# EAGLE schematic Mars (EAGLE 8.0.0)
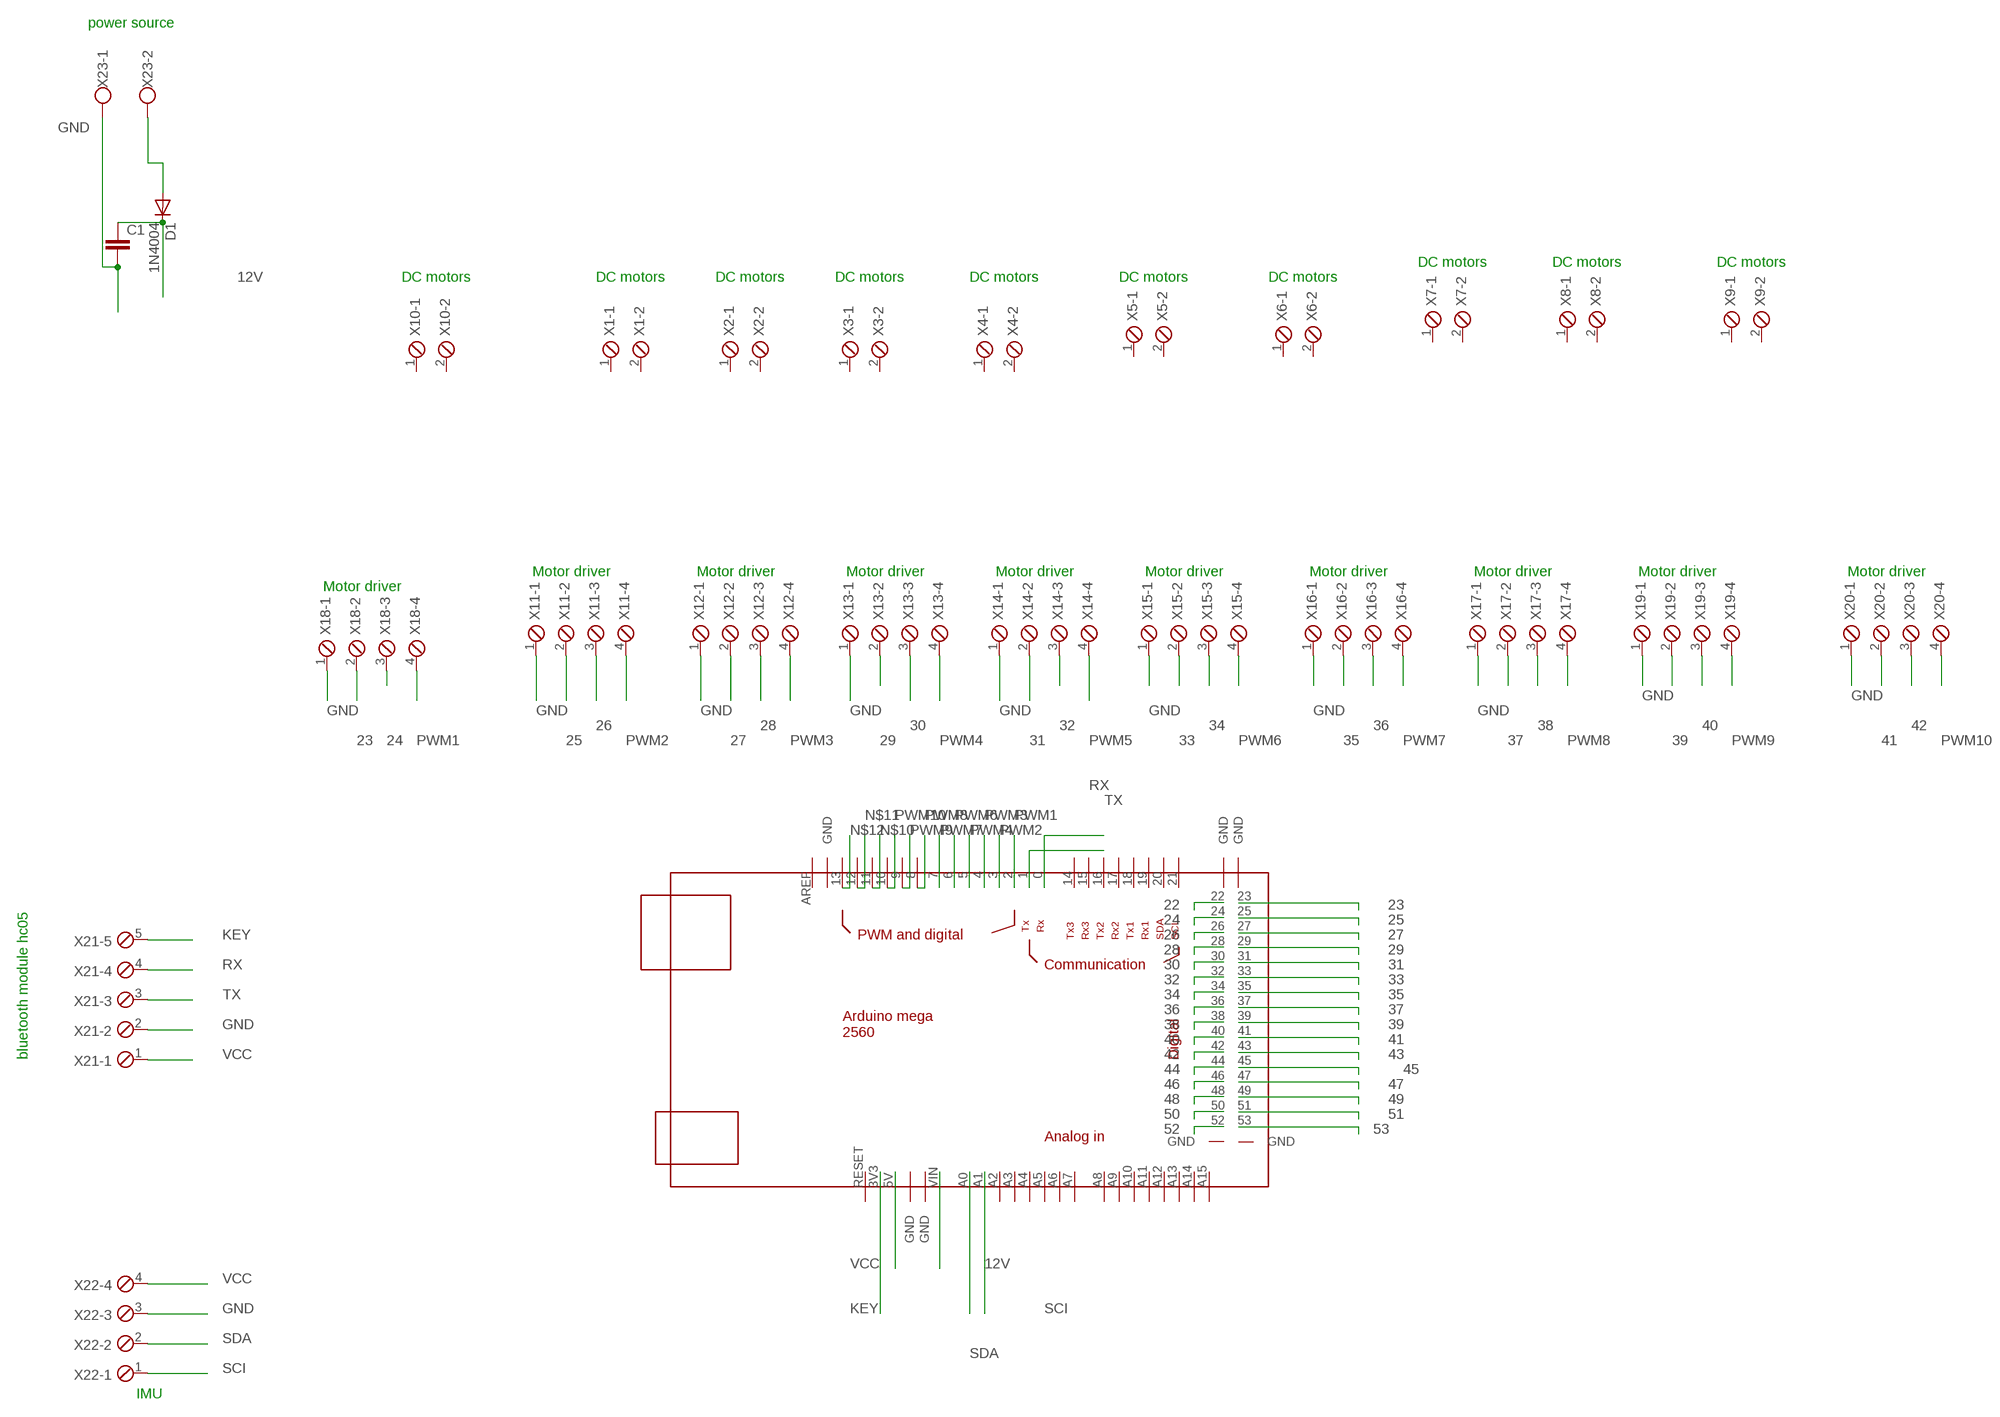
[diagram p0: schematic, sheet 1]

## Parts
C1  C-EU025-025X050  [C025-025X050]
D1  1N4004  [DO41-10]
U$1  MEGA_DEVICE  [MEGABOX]
X1  MPT2  [2POL254]
X2  MPT2  [2POL254]
X3  MPT2  [2POL254]
X4  MPT2  [2POL254]
X5  MPT2  [2POL254]
X6  MPT2  [2POL254]
X7  MPT2  [2POL254]
X8  MPT2  [2POL254]
X9  MPT2  [2POL254]
X10  MPT2  [2POL254]
X11  MPT4  [4POL254]
X12  MPT4  [4POL254]
X13  MPT4  [4POL254]
X14  MPT4  [4POL254]
X15  MPT4  [4POL254]
X16  MPT4  [4POL254]
X17  MPT4  [4POL254]
X18  MPT4  [4POL254]
X19  MPT4  [4POL254]
X20  MPT4  [4POL254]
X21  MPT5  [5POL254]
X22  MPT4  [4POL254]
X23  W237-113  [W237-113]

## Nets
12V: C1.1 D1.A D1.C U$1.VIN X23.2
22: U$1.22
23: U$1.23 X18.2
24: U$1.24 X18.3
25: U$1.25 X11.2
26: U$1.26 X11.3
27: U$1.27 X12.2
28: U$1.28 X12.3
29: U$1.29 X13.2
30: U$1.30 X13.3
31: U$1.31 X14.2
32: U$1.32 X14.3
33: U$1.33 X15.2
34: U$1.34 X15.3
35: U$1.35 X16.2
36: U$1.36 X16.3
37: U$1.37 X17.2
38: U$1.38 X17.3
39: U$1.39 X19.2
40: U$1.40 X19.3
41: U$1.41 X20.2
42: U$1.42 X20.3
43: U$1.43
44: U$1.44
45: U$1.45
46: U$1.46
47: U$1.47
48: U$1.48
49: U$1.49
50: U$1.50
51: U$1.51
52: U$1.52
53: U$1.53
GND: C1.2 X11.1 X12.1 X13.1 X14.1 X15.1 X16.1 X17.1 X18.1 X19.1 X20.1 X21.2 X22.3 X23.1
KEY: U$1.3V3 X21.5
N$10: U$1.11
N$11: U$1.12
N$12: U$1.13
PWM1: U$1.2 X18.4
PWM2: U$1.3 X11.4
PWM3: U$1.4 X12.4
PWM4: U$1.5 X13.4
PWM5: X14.4
PWM6: U$1.6 X15.4
PWM7: U$1.7 X16.4
PWM8: U$1.8 X17.4
PWM9: U$1.9 X19.4
PWM10: U$1.10 X20.4
RX: U$1.1 X21.4
SCI: U$1.A1 X22.1
SDA: U$1.A0 X22.2
TX: U$1.0 X21.3
VCC: U$1.5V X21.1 X22.4
Unconnected: U$1.14 U$1.15 U$1.16 U$1.17 U$1.18 U$1.19 U$1.20 U$1.21 U$1.A2 U$1.A3 U$1.A4 U$1.A5 U$1.A6 U$1.A7 U$1.A8 U$1.A9 U$1.A10 U$1.A11 U$1.A12 U$1.A13 U$1.A14 U$1.A15 U$1.AREF U$1.GND@1(GND) U$1.GND@2(GND) U$1.GND@3(GND) U$1.GND@4(GND) U$1.GND@5(GND) U$1.GND@6(GND) U$1.GND@7(GND) U$1.RESET X1.1 X1.2 X2.1 X2.2 X3.1 X3.2 X4.1 X4.2 X5.1 X5.2 X6.1 X6.2 X7.1 X7.2 X8.1 X8.2 X9.1 X9.2 X10.1 X10.2

## Notes on the sheet
- power source
- DC motors | DC motors | DC motors
- DC motors | DC motors | DC motors | DC motors | DC motors | DC motors | DC motors
- Motor driver | Motor driver | Motor driver | Motor driver | Motor driver | Motor driver | Motor driver | Motor driver | Motor driver
- Motor driver
- bluetooth module hc05
- IMU

## Library data of the parts
C1 = rcl:C-EU: CAPACITOR, European symbol
D1 = adafruit:1N4004: DIODE General purpose 1N400x type rectifier (With bigger pads) http://www.ladyada.net/library/pcb/eaglelibrary.html
U$1 = ArduinoMegaSymbol:MEGA_DEVICE: mega card as device
X1-X10 = con-phoenix-254:MPT2: PHOENIX CONNECTOR; OC_FARNELL: unknown; OC_NEWARK: unknown
X11-X20 X22 = con-phoenix-254:MPT4: PHOENIX CONNECTOR; OC_FARNELL: unknown; OC_NEWARK: unknown
X21 = con-phoenix-254:MPT5: PHOENIX CONNECTOR; OC_FARNELL: unknown; OC_NEWARK: unknown
X23 = con-wago-500:W237-113: WAGO SCREW CLAMP; OC_FARNELL: unknown; OC_NEWARK: unknown